# Altium schematic sheet Switches.SchDoc: Mechanical Switches
size A; Author: Parth Thakkar; Organization: Low Self Esteam; Revision: v1.0; SheetNumber: 7; SheetTotal: 8
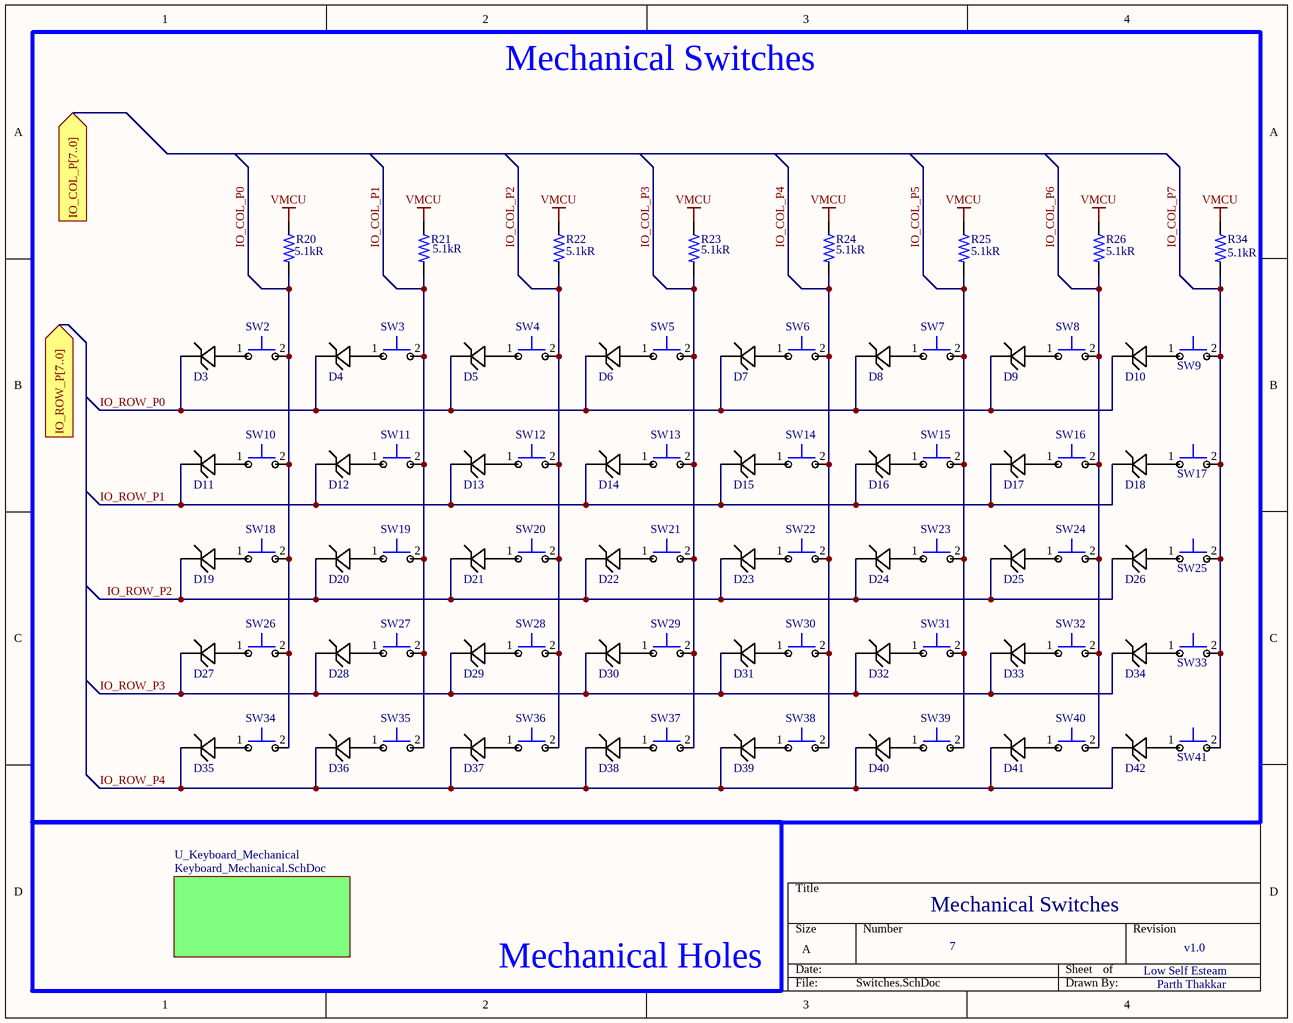
[diagram p0: Switches.SchDoc]

## Parts
D3  Diode Schottky  [Diode Schottky]  (value not drawn)
D4  Diode Schottky  [Diode Schottky]  (value not drawn)
D5  Diode Schottky  [Diode Schottky]  (value not drawn)
D6  Diode Schottky  [Diode Schottky]  (value not drawn)
D7  Diode Schottky  [Diode Schottky]  (value not drawn)
D8  Diode Schottky  [Diode Schottky]  (value not drawn)
D9  Diode Schottky  [Diode Schottky]  (value not drawn)
D10  Diode Schottky  [Diode Schottky]  (value not drawn)
D11  Diode Schottky  [Diode Schottky]  (value not drawn)
D12  Diode Schottky  [Diode Schottky]  (value not drawn)
D13  Diode Schottky  [Diode Schottky]  (value not drawn)
D14  Diode Schottky  [Diode Schottky]  (value not drawn)
D15  Diode Schottky  [Diode Schottky]  (value not drawn)
D16  Diode Schottky  [Diode Schottky]  (value not drawn)
D17  Diode Schottky  [Diode Schottky]  (value not drawn)
D18  Diode Schottky  [Diode Schottky]  (value not drawn)
D19  Diode Schottky  [Diode Schottky]  (value not drawn)
D20  Diode Schottky  [Diode Schottky]  (value not drawn)
D21  Diode Schottky  [Diode Schottky]  (value not drawn)
D22  Diode Schottky  [Diode Schottky]  (value not drawn)
D23  Diode Schottky  [Diode Schottky]  (value not drawn)
D24  Diode Schottky  [Diode Schottky]  (value not drawn)
D25  Diode Schottky  [Diode Schottky]  (value not drawn)
D26  Diode Schottky  [Diode Schottky]  (value not drawn)
D27  Diode Schottky  [Diode Schottky]  (value not drawn)
D28  Diode Schottky  [Diode Schottky]  (value not drawn)
D29  Diode Schottky  [Diode Schottky]  (value not drawn)
D30  Diode Schottky  [Diode Schottky]  (value not drawn)
D31  Diode Schottky  [Diode Schottky]  (value not drawn)
D32  Diode Schottky  [Diode Schottky]  (value not drawn)
D33  Diode Schottky  [Diode Schottky]  (value not drawn)
D34  Diode Schottky  [Diode Schottky]  (value not drawn)
D35  Diode Schottky  [Diode Schottky]  (value not drawn)
D36  Diode Schottky  [Diode Schottky]  (value not drawn)
D37  Diode Schottky  [Diode Schottky]  (value not drawn)
D38  Diode Schottky  [Diode Schottky]  (value not drawn)
D39  Diode Schottky  [Diode Schottky]  (value not drawn)
D40  Diode Schottky  [Diode Schottky]  (value not drawn)
D41  Diode Schottky  [Diode Schottky]  (value not drawn)
D42  Diode Schottky  [Diode Schottky]  (value not drawn)
R20  value 5.1kR  [Resistor 0603]  (hidden comment: RES 5.1K 0603)
R21  value 5.1kR  [Resistor 0603]  (hidden comment: RES 5.1K 0603)
R22  value 5.1kR  [Resistor 0603]  (hidden comment: RES 5.1K 0603)
R23  value 5.1kR  [Resistor 0603]  (hidden comment: RES 5.1K 0603)
R24  value 5.1kR  [Resistor 0603]  (hidden comment: RES 5.1K 0603)
R25  value 5.1kR  [Resistor 0603]  (hidden comment: RES 5.1K 0603)
R26  value 5.1kR  [Resistor 0603]  (hidden comment: RES 5.1K 0603)
R34  value 5.1kR  [Resistor 0603]  (hidden comment: RES 5.1K 0603)
SW2  Gateron G Pro 2.0  [Mechanical Switch]  (value not drawn)
SW3  Gateron G Pro 2.0  [Mechanical Switch]  (value not drawn)
SW4  Gateron G Pro 2.0  [Mechanical Switch]  (value not drawn)
SW5  Gateron G Pro 2.0  [Mechanical Switch]  (value not drawn)
SW6  Gateron G Pro 2.0  [Mechanical Switch]  (value not drawn)
SW7  Gateron G Pro 2.0  [Mechanical Switch]  (value not drawn)
SW8  Gateron G Pro 2.0  [Mechanical Switch]  (value not drawn)
SW9  Gateron G Pro 2.0  [Mechanical Switch]  (value not drawn)
SW10  Gateron G Pro 2.0  [Mechanical Switch]  (value not drawn)
SW11  Gateron G Pro 2.0  [Mechanical Switch]  (value not drawn)
SW12  Gateron G Pro 2.0  [Mechanical Switch]  (value not drawn)
SW13  Gateron G Pro 2.0  [Mechanical Switch]  (value not drawn)
SW14  Gateron G Pro 2.0  [Mechanical Switch]  (value not drawn)
SW15  Gateron G Pro 2.0  [Mechanical Switch]  (value not drawn)
SW16  Gateron G Pro 2.0  [Mechanical Switch]  (value not drawn)
SW17  Gateron G Pro 2.0  [Mechanical Switch]  (value not drawn)
SW18  Gateron G Pro 2.0  [Mechanical Switch]  (value not drawn)
SW19  Gateron G Pro 2.0  [Mechanical Switch]  (value not drawn)
SW20  Gateron G Pro 2.0  [Mechanical Switch]  (value not drawn)
SW21  Gateron G Pro 2.0  [Mechanical Switch]  (value not drawn)
SW22  Gateron G Pro 2.0  [Mechanical Switch]  (value not drawn)
SW23  Gateron G Pro 2.0  [Mechanical Switch]  (value not drawn)
SW24  Gateron G Pro 2.0  [Mechanical Switch]  (value not drawn)
SW25  Gateron G Pro 2.0  [Mechanical Switch]  (value not drawn)
SW26  Gateron G Pro 2.0  [Mechanical Switch]  (value not drawn)
SW27  Gateron G Pro 2.0  [Mechanical Switch]  (value not drawn)
SW28  Gateron G Pro 2.0  [Mechanical Switch]  (value not drawn)
SW29  Gateron G Pro 2.0  [Mechanical Switch]  (value not drawn)
SW30  Gateron G Pro 2.0  [Mechanical Switch]  (value not drawn)
SW31  Gateron G Pro 2.0  [Mechanical Switch]  (value not drawn)
SW32  Gateron G Pro 2.0  [Mechanical Switch]  (value not drawn)
SW33  Gateron G Pro 2.0  [Mechanical Switch]  (value not drawn)
SW34  Gateron G Pro 2.0  [Mechanical Switch]  (value not drawn)
SW35  Gateron G Pro 2.0  [Mechanical Switch]  (value not drawn)
SW36  Gateron G Pro 2.0  [Mechanical Switch]  (value not drawn)
SW37  Gateron G Pro 2.0  [Mechanical Switch]  (value not drawn)
SW38  Gateron G Pro 2.0  [Mechanical Switch]  (value not drawn)
SW39  Gateron G Pro 2.0  [Mechanical Switch]  (value not drawn)
SW40  Gateron G Pro 2.0  [Mechanical Switch]  (value not drawn)
SW41  Gateron G Pro 2.0  [Mechanical Switch]  (value not drawn)

## Blocks framed on the sheet
Mechanical Switches: D3-D42 R20-R26 R34 SW2-SW41

## Sub-sheets
U_Keyboard_Mechanical = Keyboard_Mechanical.SchDoc: no entries

## Ports
IO_COL_P[7..0] (in, see Keyboard-Left[3B], Peripherals[1A]), IO_ROW_P[7..0] (in, see Keyboard-Left[3B], Peripherals[1A])

## Nets
VMCU: R20.1 R21.1 R22.1 R23.1 R24.1 R25.1 R26.1 R34.1
IO_COL_P0: R20.2 SW2.2 SW10.2 SW18.2 SW26.2 SW34.2
IO_COL_P1: R21.2 SW3.2 SW11.2 SW19.2 SW27.2 SW35.2
IO_COL_P2: R22.2 SW4.2 SW12.2 SW20.2 SW28.2 SW36.2
IO_COL_P3: R23.2 SW5.2 SW13.2 SW21.2 SW29.2 SW37.2
IO_COL_P4: R24.2 SW6.2 SW14.2 SW22.2 SW30.2 SW38.2
IO_COL_P5: R25.2 SW7.2 SW15.2 SW23.2 SW31.2 SW39.2
IO_COL_P6: R26.2 SW8.2 SW16.2 SW24.2 SW32.2 SW40.2
IO_COL_P7: R34.2 SW9.2 SW17.2 SW25.2 SW33.2 SW41.2
IO_ROW_P0: D3.1 D4.1 D5.1 D6.1 D7.1 D8.1 D9.1 D10.1
IO_ROW_P1: D11.1 D12.1 D13.1 D14.1 D15.1 D16.1 D17.1 D18.1
IO_ROW_P2: D19.1 D20.1 D21.1 D22.1 D23.1 D24.1 D25.1 D26.1
IO_ROW_P3: D27.1 D28.1 D29.1 D30.1 D31.1 D32.1 D33.1 D34.1
IO_ROW_P4: D35.1 D36.1 D37.1 D38.1 D39.1 D40.1 D41.1 D42.1
NetD3_2: D3.2 SW2.1
NetD4_2: D4.2 SW3.1
NetD5_2: D5.2 SW4.1
NetD6_2: D6.2 SW5.1
NetD7_2: D7.2 SW6.1
NetD8_2: D8.2 SW7.1
NetD9_2: D9.2 SW8.1
NetD10_2: D10.2 SW9.1
NetD11_2: D11.2 SW10.1
NetD12_2: D12.2 SW11.1
NetD13_2: D13.2 SW12.1
NetD14_2: D14.2 SW13.1
NetD15_2: D15.2 SW14.1
NetD16_2: D16.2 SW15.1
NetD17_2: D17.2 SW16.1
NetD18_2: D18.2 SW17.1
NetD19_2: D19.2 SW18.1
NetD20_2: D20.2 SW19.1
NetD21_2: D21.2 SW20.1
NetD22_2: D22.2 SW21.1
NetD23_2: D23.2 SW22.1
NetD24_2: D24.2 SW23.1
NetD25_2: D25.2 SW24.1
NetD26_2: D26.2 SW25.1
NetD27_2: D27.2 SW26.1
NetD28_2: D28.2 SW27.1
NetD29_2: D29.2 SW28.1
NetD30_2: D30.2 SW29.1
NetD31_2: D31.2 SW30.1
NetD32_2: D32.2 SW31.1
NetD33_2: D33.2 SW32.1
NetD34_2: D34.2 SW33.1
NetD35_2: D35.2 SW34.1
NetD36_2: D36.2 SW35.1
NetD37_2: D37.2 SW36.1
NetD38_2: D38.2 SW37.1
NetD39_2: D39.2 SW38.1
NetD40_2: D40.2 SW39.1
NetD41_2: D41.2 SW40.1
NetD42_2: D42.2 SW41.1

## Notes on the sheet
- Mechanical Holes

## Library data of the parts
D3-D42 = Diode Schottky: Rectifier Diode, Schottky, 1 Phase, 1 Element, 1A, 15V V(RRM), Silicon, DO-214BA; Manufacturer: Microchip; Manufacturer Part Number: LSM115JE3/TR13; Value: 150pF; Element Configuration: 5460ElementConfiguration; Forward Voltage: 220mV; Max Forward Surge Current (Ifsm): 50A; Max Reverse Current: 10mA; Supplier: Digikey; Supplier Part Number: 150-LSM115JE3/TR13CT-ND; RoHS: Yes; Category: Rectifier Diodes; Stock: 87281; Pricing: 1=0.55, 100=0.5 (USD); Mounting Technology: 8Mount; Pins: 2NUMBER; Weight: 103.986051mg; Min Operating Temperature: -55°C; Max Operating Temperature: 100°C; Average Rectified Current: 1A; Forward Current: 1A; Packaging: 10Packaging; Max Repetitive Reverse Voltage (Vrrm): 15V; Max Reverse Voltage (DC): 15V; Peak Non-Repetitive Surge Current: 50A; Reverse Voltage: 15V; Reverse Voltage (DC): 15V; Height: 2.92mm; Radiation Hardening: 5898YesNo; Lead Free: 5697LeadFree; ComponentLink1URL: https://datasheet.octopart.com/LSM115JE3-TR13-Microchip-datasheet-175858636.pdf?src-supplier=microchipDIRECT; ComponentLink1Description: https://datasheet.octopart.com/LSM115JE3-TR13-Microchip-datasheet-175858636.pdf?src-supplier=microchipDIRECT; ComponentLink2URL: https://datasheet.octopart.com/LSM115JE3-TR13-Microchip-datasheet-175858635.pdf?src-supplier=Master+Electronics; ComponentLink2Description: https://datasheet.octopart.com/LSM115JE3-TR13-Microchip-datasheet-175858635.pdf?src-supplier=Master+Electronics
R20-R26 R34 = RES 5.1K 0603: Fixed Resistor, Metal Glaze/thick Film, 0.1W, 5100ohm, 75V, 1% +/-Tol, 100ppm/Cel, Surface Mount, 0603; Manufacturer: Yageo; Manufacturer Part Number: RC0603FR-075K1L; Additional Feature: LASER TRIMMABLE; Power: 100mW; Rated Temperature: 70°C; Temperature Coefficient: 100ppm/°C; Package Height: 0.45mm; Package Length: 1.6mm; Package Width: 0.8mm; Supplier: Digikey; Supplier Part Number: 311-5.10KHRCT-ND; RoHS: Yes; Category: Chip SMD Resistors; Stock: 2084844; Pricing: 1=0.1, 10=0.019, 50=0.0112, 100=0.0093, 500=0.00622, 1000=0.00532, 5000=0.00382, 10000=0.00335, 25000=0.00287, 35000=0.00278, 50000=0.00257, 125000=0.00232 (USD); Mounting Technology: Surface Mount; Pins: 2; Package Shape: Rectangular; Case/Package: 0603; Terminal Finish: Nickel; Min Operating Temperature: -55°C; Max Operating Temperature: 155°C; Tolerance: 1%; JESD-609 Code: e3; Resistor Type: FIXED RESISTOR; Construction: Chip; Package Style: SMTMeter; Packaging: Tape and Reel; Technology: METAL GLAZE/THICK FILM; Termination: Wraparound; Working Voltage: 75V; Reach SVHC Compliant: Yes; RoHS Compliant: Yes; ComponentLink1URL: https://datasheet.ciiva.com:443/pdfs/VipMasterIC/IC/YAGO/YAGO-S-A0008145938/YAGO-S-A0008145938-1.pdf?src-supplier=IHS+Markit; ComponentLink1Description: https://datasheet.ciiva.com:443/pdfs/VipMasterIC/IC/YAGO/YAGO-S-A0008145938/YAGO-S-A0008145938-1.pdf?src-supplier=IHS+Markit; ComponentLink2URL: https://datasheet.ciiva.com/46395/443971-46395016.pdf?src-supplier=Element14; ComponentLink2Description: https://datasheet.ciiva.com/46395/443971-46395016.pdf?src-supplier=Element14; ComponentLink3URL: https://datasheet.ciiva.com/2454/pyu-r-int-thick-7-2454045.pdf?src-supplier=Digikey; ComponentLink3Description: https://datasheet.ciiva.com/2454/pyu-r-int-thick-7-2454045.pdf?src-supplier=Digikey; ComponentLink4URL: https://datasheet.ciiva.com/2454/pyu-r-int-thick-7-2454046.pdf?src-supplier=Digikey; ComponentLink4Description: https://datasheet.ciiva.com/2454/pyu-r-int-thick-7-2454046.pdf?src-supplier=Digikey; ComponentLink5URL: https://datasheet.ciiva.com/2454/pyu-r-int-thick-7-2454047.pdf?src-supplier=Digikey; ComponentLink5Description: https://datasheet.ciiva.com/2454/pyu-r-int-thick-7-2454047.pdf?src-supplier=Digikey; ComponentLink6URL: https://datasheet.ciiva.com/15189/getdatasheetpartid-326732-15189786.pdf?src-supplier=Verical; ComponentLink6Description: https://datasheet.ciiva.com/15189/getdatasheetpartid-326732-15189786.pdf?src-supplier=Verical
SW2-SW41 = Gateron G Pro 2.0: Gateron G Pro 2.0, The 3-Pin switches are compatible with any 3-Pin/5-Pin MX mechanical keyboard